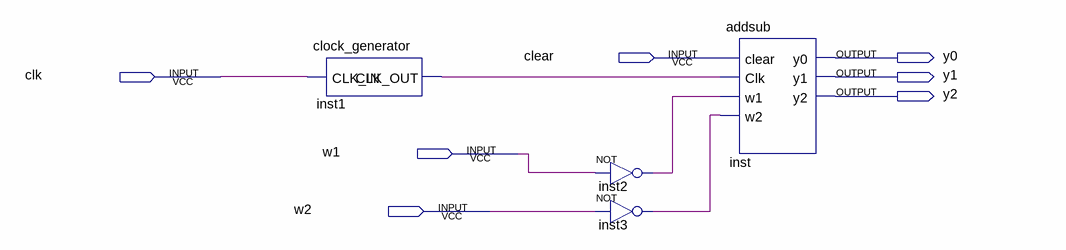
[diagram p0: schematic sheet]
// Quartus schematic try.bdf as structural Verilog: 4 symbols, 7 pins
module try (
  input  clear,
  input  clk,
  input  w1,
  input  w2,
  output y0,
  output y1,
  output y2
);

  wire inst1_clk_out, inst2_out, inst3_out;

  clock_generator inst1 (.CLK_IN(clk), .CLK_OUT(inst1_clk_out));
  not inst2 (inst2_out, w1);
  not inst3 (inst3_out, w2);
  addsub inst (.clear(clear), .Clk(inst1_clk_out), .w1(inst2_out), .w2(inst3_out), .y0(y0), .y1(y1), .y2(y2));
endmodule
